# EAGLE design PMNv1-1H (EAGLE 9.5.2)
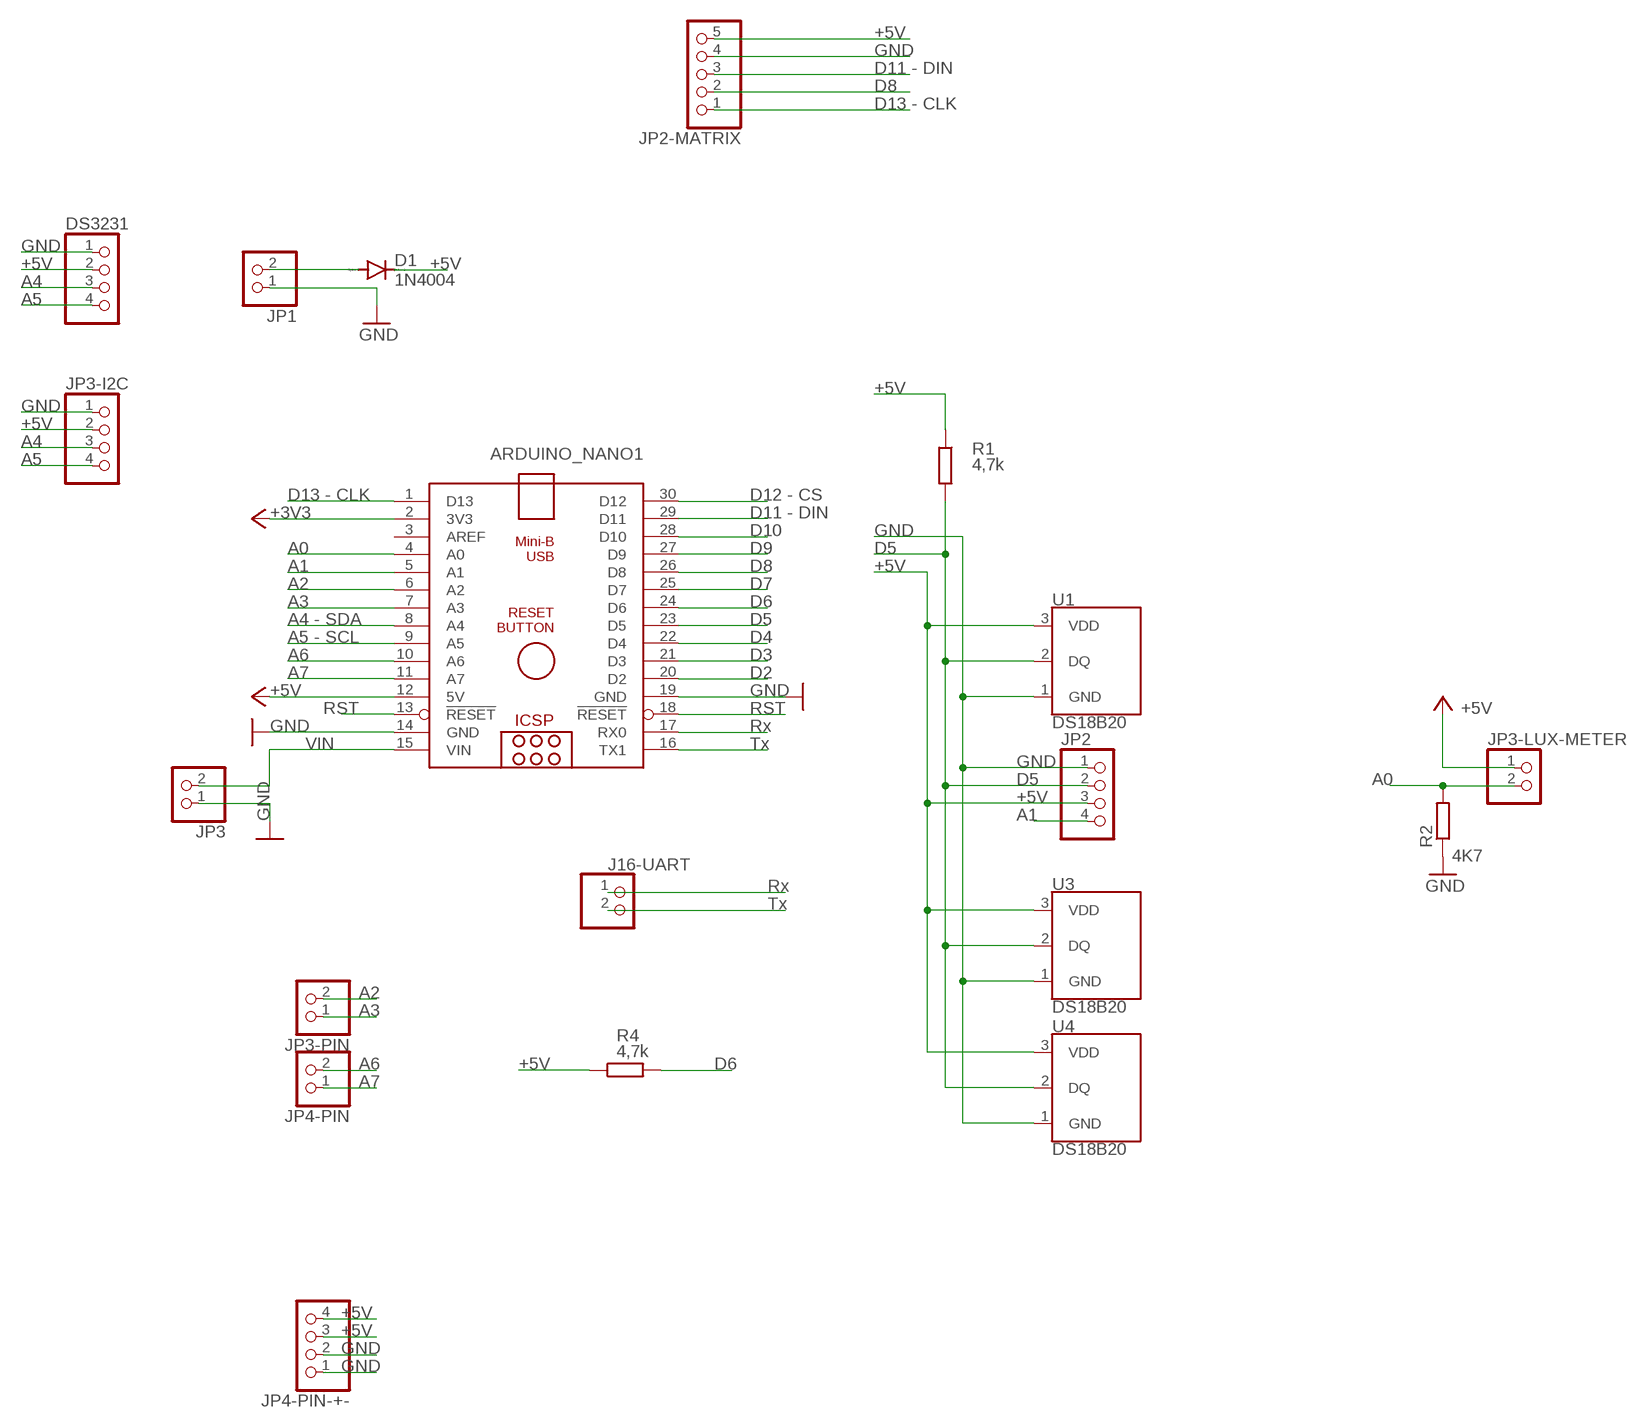
[diagram p0: schematic, sheet 1]

## Parts
ARDUINO_NANO1  ARDUINO_NANO  [ARDUINO_NANO]
D1  1N4004  [DO41-10]
DS3231  PINHD-1X4  [1X04]
J16-UART  PINHD-1X2  [1X02]
JP1  PINHD-1X2  [1X02]
JP2  PINHD-1X4  [1X04]
JP2-MATRIX  PINHD-1X5  [1X05]
JP3  PINHD-1X2  [1X02]
JP3-I2C  PINHD-1X4  [1X04]
JP3-LUX-METER  PINHD-1X2  [1X02]
JP3-PIN  PINHD-1X2  [1X02]
JP4-PIN  PINHD-1X2  [1X02]
JP4-PIN-+-  PINHD-1X4  [1X04]
R1  4,7k  R-EU_0204/7  [0204/7]
R2  4K7  R-EU_0207/10  [0207/10]
R4  4,7k  R-EU_0204/7  [0204/7]
U1  DS18B20  [TO-92-AMMO]
U3  DS18B20  [TO-92-AMMO]
U4  DS18B20  [TO-92-AMMO]

## Nets
+3V3: ARDUINO_NANO1.2(3V3)
+5V: ARDUINO_NANO1.12(5V) D1.C DS3231.2 JP2-MATRIX.5 JP2.3 JP3-I2C.2 JP3-LUX-METER.1 JP4-PIN-+-.3 JP4-PIN-+-.4 R1.1 R4.1 U1.3(VDD) U3.3(VDD) U4.3(VDD)
A0: ARDUINO_NANO1.4(A0) JP3-LUX-METER.2 R2.2
A1: ARDUINO_NANO1.5(A1) JP2.4
A2: ARDUINO_NANO1.6(A2) JP3-PIN.2
A3: ARDUINO_NANO1.7(A3) JP3-PIN.1
A4: ARDUINO_NANO1.8(A4) DS3231.3 JP3-I2C.3
A5: ARDUINO_NANO1.9(A5) DS3231.4 JP3-I2C.4
A6: ARDUINO_NANO1.10(A6) JP4-PIN.2
A7: ARDUINO_NANO1.11(A7) JP4-PIN.1
D2: ARDUINO_NANO1.20(D2)
D3: ARDUINO_NANO1.21(D3)
D4: ARDUINO_NANO1.22(D4)
D5: ARDUINO_NANO1.23(D5) JP2.2 R1.2 U1.2(DQ) U3.2(DQ) U4.2(DQ)
D6: ARDUINO_NANO1.24(D6) R4.2
D7: ARDUINO_NANO1.25(D7)
D8: ARDUINO_NANO1.26(D8) JP2-MATRIX.2
D9: ARDUINO_NANO1.27(D9)
D10: ARDUINO_NANO1.28(D10)
D11: ARDUINO_NANO1.29(D11) JP2-MATRIX.3
D12: ARDUINO_NANO1.30(D12)
D13: ARDUINO_NANO1.1(D13) JP2-MATRIX.1
GND: ARDUINO_NANO1.14(GND) ARDUINO_NANO1.19(GND) DS3231.1 JP1.1 JP2-MATRIX.4 JP2.1 JP3-I2C.1 JP3.1 JP4-PIN-+-.1 JP4-PIN-+-.2 R2.1 U1.1(GND) U3.1(GND) U4.1(GND)
N$2: D1.A JP1.2
RST: ARDUINO_NANO1.13(!RESET) ARDUINO_NANO1.18(!RESET)
RX: ARDUINO_NANO1.17(RX0) J16-UART.1
TX: ARDUINO_NANO1.16(TX1) J16-UART.2
VIN: ARDUINO_NANO1.15(VIN) JP3.2
Unconnected: ARDUINO_NANO1.3(AREF)

## Notes on the sheet
- +5V
- GND
- D11 - DIN
- D13 - CLK
- +5V
- D13 - CLK | D12 - CS
- D11 - DIN
- D10 | GND
- A0 | D9 | D5
- A1 | D8 | +5V
- A2 | D7
- A3 | D6
- A4 - SDA | D5
- A5 - SCL | D4
- A6 | D3
- A7 | D2
- Rx
- VIN | Tx
- Rx
- Tx
- +5V | D6

## Library data of the parts
ARDUINO_NANO1 = ArduinoNanoV30:ARDUINO_NANO: Arduino Nano V3.0 Overview: The Arduino Nano is a small, complete, and breadboard-friendly board based on the ATmega328 (Arduino Nano 3.x) or ATmega168 (Arduino Nano 2.x). It has more or less the same functionality of the Arduino Duemilanove, but in a different package. It lacks only a DC power jack, and works with a Mini-B USB cable instead of a standard one. The Nano was designed and is being produced by Gravitech. Specifications: Microcontroller Atmel ATmega168 or ATmega328 Operating Voltage (logic level) 5 V Input Voltage (recommended) 7-12 V Input Voltage (limits) 6-20 V Digital I/O Pins 14 (of which 6 provide PWM output) Analog Input Pins 8 DC Current per I/O Pin 40 mA Flash Memory 16 KB (ATmega168) or 32 KB (ATmega328) of which 2 KB used by bootloader SRAM 1 KB (ATmega168) or 2 KB (ATmega328) EEPROM 512 bytes (ATmega168) or 1 KB (ATmega328) Clock Speed 16 MHz Dimensions 0.73" x 1.70" Length 45 mm Width 18 mm Weigth 5 g Power: The Arduino Nano can be powered via the Mini-B USB connection, 6-20V unregulated external power supply (pin 30), or 5V regulated external power supply (pin 27). The power source is automatically selected to the highest voltage source. Memory: The ATmega168 has 16 KB of flash memory for storing code (of which 2 KB is used for the bootloader); the ATmega328 has 32 KB, (also with 2 KB used for the bootloader). The ATmega168 has 1 KB of SRAM and 512 bytes of EEPROM (which can be read and written with the EEPROM library); the ATmega328 has 2 KB of SRAM and 1 KB of EEPROM. Input and Output: Each of the 14 digital pins on the Nano can be used as an input or output, using pinMode(), digitalWrite(), and digitalRead() functions. They operate at 5 volts. Each pin can provide or receive a maximum of 40 mA and has an internal pull-up resistor (disconnected by default) of 20-50 kOhms. In addition, some pins have specialized functions. Visit Arduino - ArduinoBoardNano <https://www.arduino.cc/en/Main/ArduinoBoardNano>
D1 = diode:1N4004: DIODE general purpose rectifier, 1 A
DS3231 JP2 JP3-I2C JP4-PIN-+- = pinhead:PINHD-1X4: PIN HEADER
J16-UART JP1 JP3 JP3-LUX-METER JP3-PIN JP4-PIN = pinhead:PINHD-1X2: PIN HEADER
JP2-MATRIX = pinhead:PINHD-1X5: PIN HEADER
R1 R4 = rcl:R-EU_: RESISTOR, European symbol
R2 = rcl:R-EU_: RESISTOR, European symbol; SPICEPREFIX: R
U1 U3 U4 = SparkFun-Sensors:DS18B20: Dallas/Maxim DS18B20 1-Wire Temperature Sensor The DS18B20 reports degrees C with 9 to 12-bit precision, -55C to 125C (+/-0.5C). Each sensor has a unique 64-Bit Serial number etched into it - allows for a huge number of sensors to be used on one data bus. Datasheet <http://datasheets.maximintegrated.com/en/ds/DS18B20.pdf> SparkFun Products One Wire Digital Temperature Sensor - DS18B20 <https://www.sparkfun.com/products/245> (SEN-00245); STORE_ID: SEN-00245

## Board
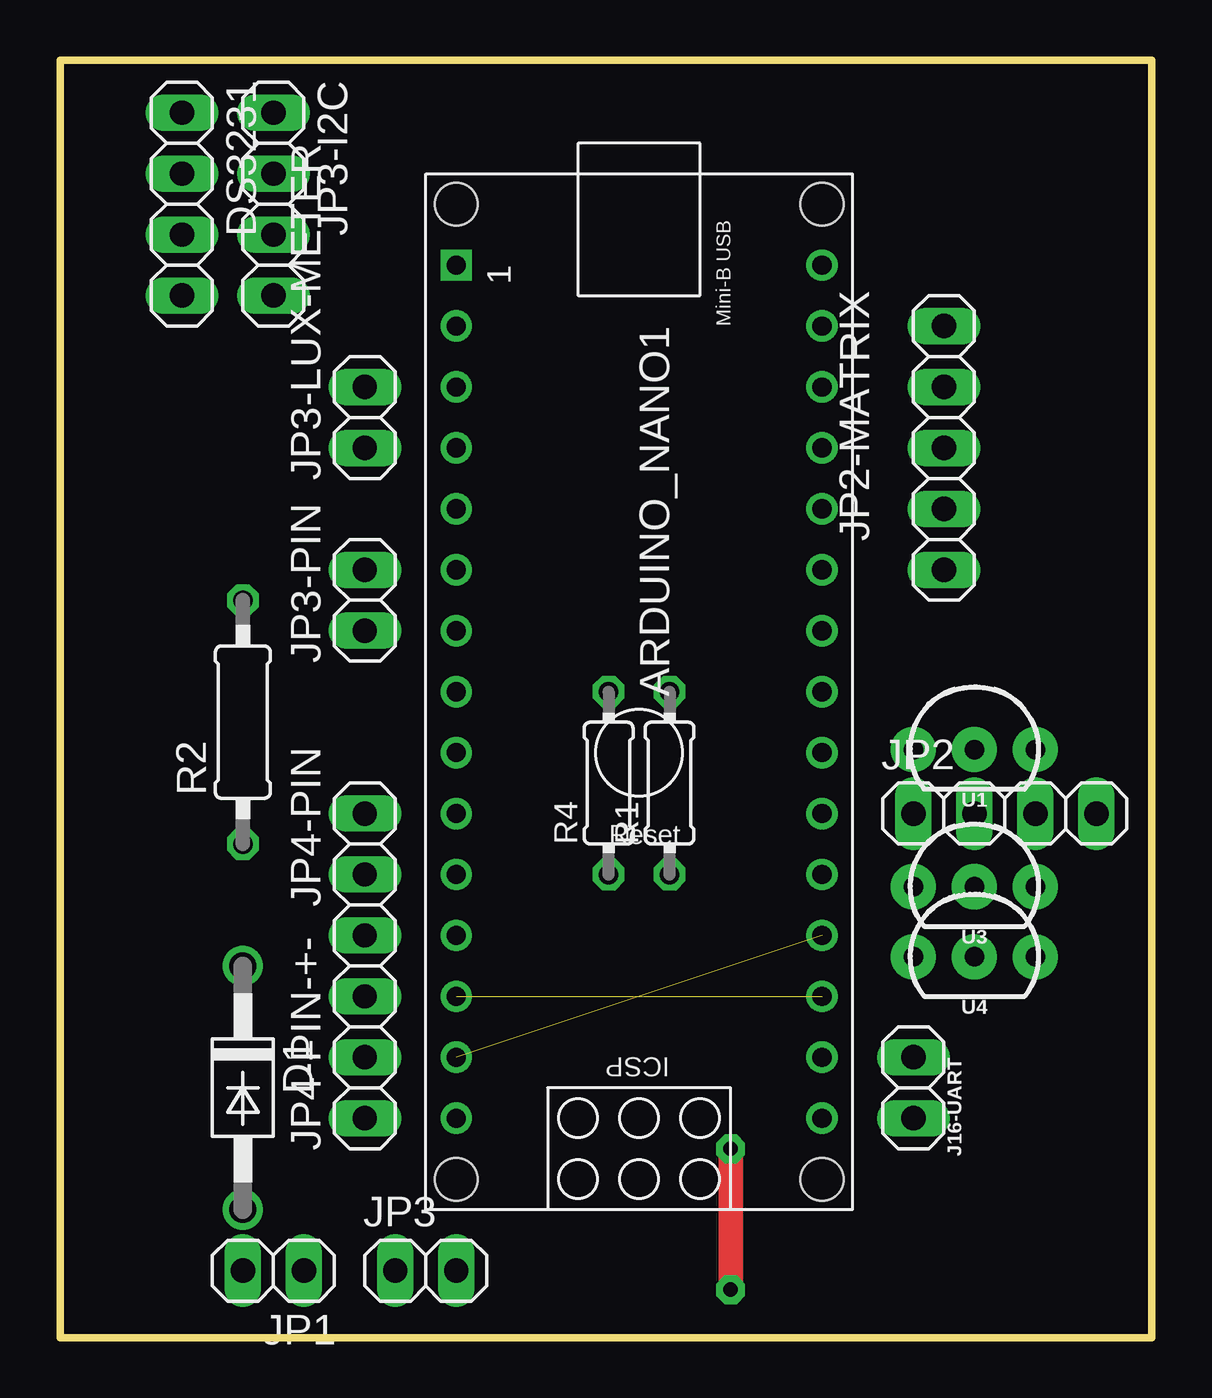
[diagram p1: board, top side]
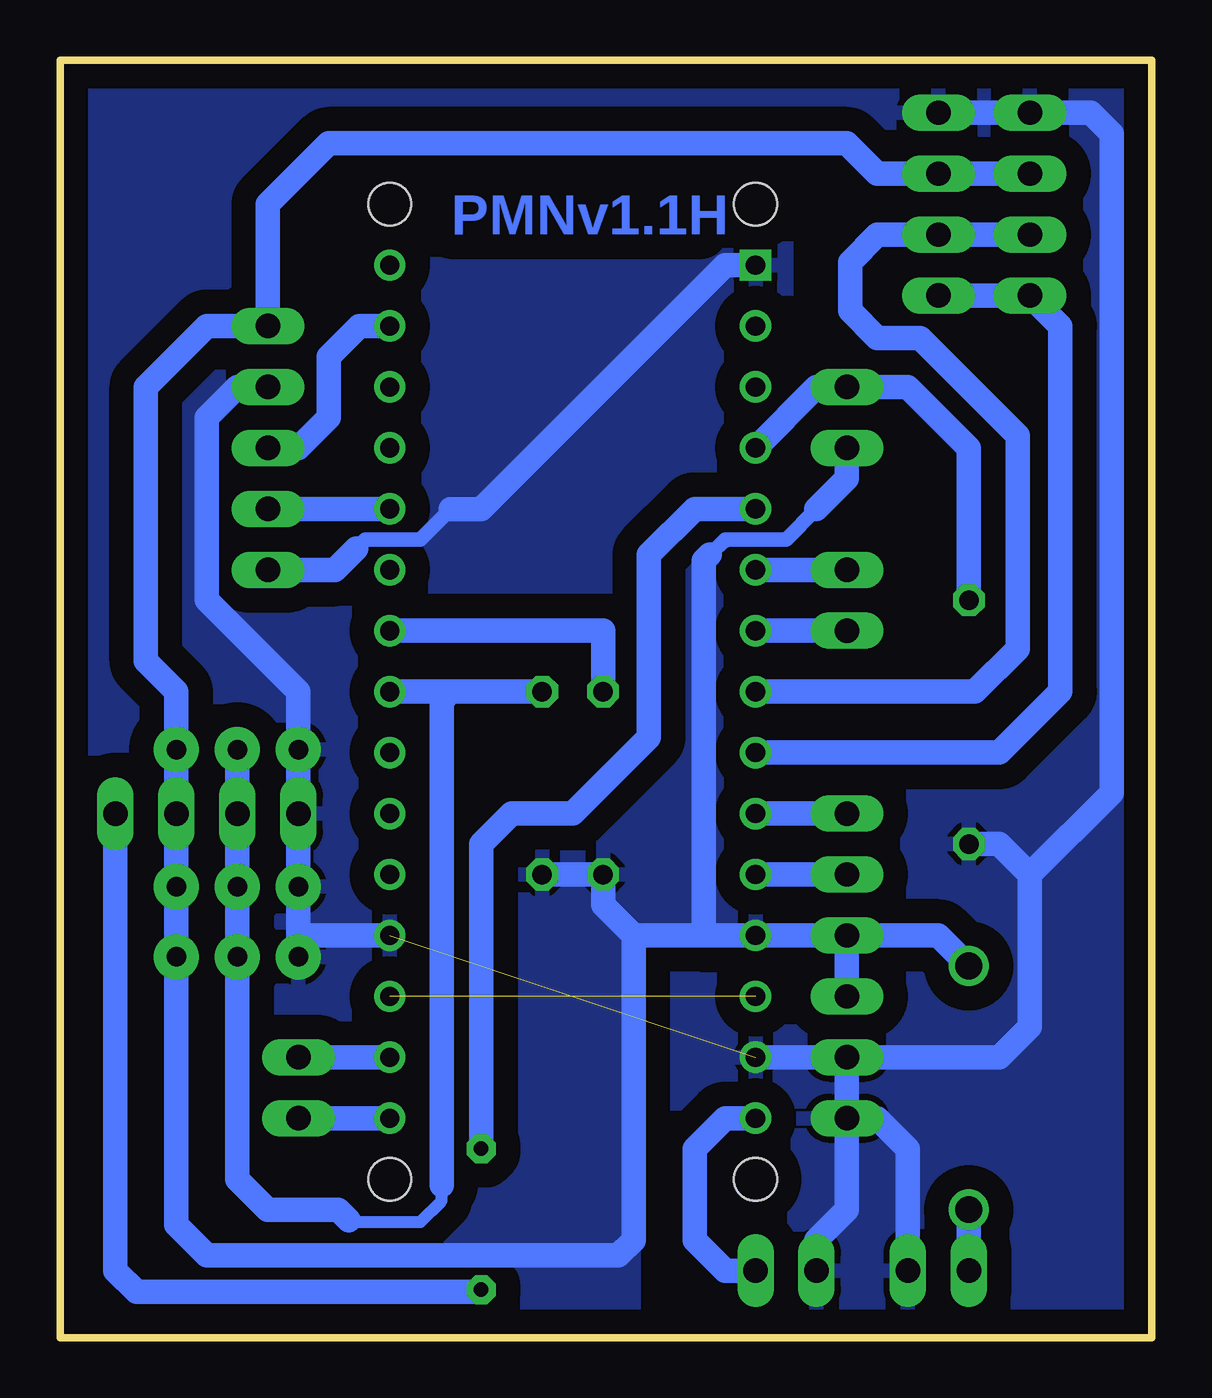
[diagram p2: board, bottom side, seen from below]

Size 45.49 x 53.25 mm. Coordinates in mm from the lower left corner, seen from the top.
Outline: 0,0 45.49,0 45.49,53.25 0,53.25 0,0
Copper layers (1*16): Top 0.035mm / dielectric 1.5mm / Bottom 0.035mm
Design rules "default": minimum track width 6mil, minimum drill 0.35mm, track to track 6mil, track to pad 6mil, pad to pad 6mil, via to via 6mil, smd to smd 6mil, copper to edge 40mil, drill to drill 6mil, minimum pad ring 10mil, minimum via ring 8mil, stop-mask expansion 4mil, vias tented up to drill 0mil, thermal gap 10mil
Holes 3 mm at -10.16,58.67

### Footprints (pad centres in the part's own frame; a part is rotated, then mirrored left to right if it is on the bottom)
ARDUINO_NANO = drill 0.8 square: 1 -20.32,-7.62 | drill 0.8: 2 -17.78,-7.62; 3 -15.24,-7.62; 4 -12.7,-7.62; 5 -10.16,-7.62; 6 -7.62,-7.62; 7 -5.08,-7.62; 8 -2.54,-7.62; 9 0,-7.62; 10 2.54,-7.62; 11 5.08,-7.62; 12 7.62,-7.62; 13 10.16,-7.62; 14 12.7,-7.62; 15 15.24,-7.62; 16 15.24,7.62; 17 12.7,7.62; 18 10.16,7.62; 19 7.62,7.62; 20 5.08,7.62; 21 2.54,7.62; 22 0,7.62; 23 -2.54,7.62; 24 -5.08,7.62; 25 -7.62,7.62; 26 -10.16,7.62; 27 -12.7,7.62; 28 -15.24,7.62; 29 -17.78,7.62; 30 -20.32,7.62 | hole 1.778: -22.86,-7.62; -22.86,7.62; 17.78,7.62; 17.78,-7.62
DO41-10 = drill 1.118: A 5.08,0; C -5.08,0
1X04 = drill 1.016 long: 1 -3.81,0; 2 -1.27,0; 3 1.27,0; 4 3.81,0
1X02 = drill 1.016 long: 1 -1.27,0; 2 1.27,0
1X05 = drill 1.016 long: 1 -5.08,0; 2 -2.54,0; 3 0,0; 4 2.54,0; 5 5.08,0
0204/7 = drill 0.813 octagon: 1 -3.81,0; 2 3.81,0
0207/10 = drill 0.813 octagon: 1 -5.08,0; 2 5.08,0
TO-92-AMMO = drill 0.813 pad 1.88: 1 -2.54,0; 2 0,0; 3 2.54,0

### Placement (x,y rotation side)
ARDUINO_NANO1  24.13,24.38 270 top
D1  7.62,10.41 270 top
DS3231  5.08,47.24 270 top
J16-UART  35.56,10.41 270 top
JP1  8.89,2.79 180 top
JP2  39.37,21.84 0 top
JP2-MATRIX  36.83,37.08 90 top
JP3  15.24,2.79 0 top
JP3-I2C  8.89,47.24 270 top
JP3-LUX-METER  12.7,38.35 90 top
JP3-PIN  12.7,30.73 90 top
JP4-PIN  12.7,20.57 90 top
JP4-PIN-+-  12.7,12.95 90 top
R1  25.4,23.11 90 top
R2  7.62,25.65 90 top
R4  22.86,23.11 90 top
U1  38.1,24.51 0 top
U3  38.1,18.8 0 top
U4  38.1,15.88 0 top

### Tracks (layer width: path | path; a pad name or v marks a point on that pad's centre or on a via)
+5V
  Bottom 0.61: 13.97,34.54 15.24,33.27 17.68,33.27 | 17.73,33.23 17.68,33.27 | 17.68,33.27 17.78,33.27 18.41,32.64
  Bottom 1.016: R1.1 R4.1 22.86,18.03 21.59,16.76 | JP4-PIN-+-.3 JP4-PIN-+-.4 | U3.3 JP2.3 U1.3 40.64,26.92 41.91,28.19 41.91,39.62 39.37,42.16 JP2-MATRIX.5 36.83,47.24 34.29,49.78 12.7,49.78 11.43,48.51 JP3-I2C.2 DS3231.2 | 40.64,18.03 U3.3 | U3.3 U4.3 40.64,4.7 39.37,3.43 22.22,3.43 21.59,4.06 21.59,16.76 | D1.C 8.89,16.76 JP4-PIN-+-.4 | JP4-PIN-+-.4 ARDUINO_NANO1.12 18.67,16.76 | 18.67,16.76 21.59,16.76 | JP3-LUX-METER.1 12.7,35.81 13.97,34.54 | 18.41,32.64 18.67,32.38 18.67,16.76
  pour Bottom (isolate 1.016, rank 4): 20.32,0.25 21.59,1.52 21.59,18.03 20.32,16.76 16.51,16.76 16.51,32 20.32,32 29.21,23.11 29.21,0.25
A0
  Bottom 1.016: ARDUINO_NANO1.4 13.97,39.62 JP3-LUX-METER.2 10.16,39.62 7.62,37.08 R2.2
A1  (via drill 0.6 pad 1.2)
  Top 1.016: v27.94,7.87 v27.94,2
  Bottom 1.016: ARDUINO_NANO1.5 19.05,34.54 20.96,32.64 20.96,25.02 24.13,21.84 26.67,21.84 27.94,20.57 v27.94,7.87 | v27.94,2 27.94,1.91 42.29,1.91 43.18,2.79 JP2.4
A2
  Bottom 1.016: ARDUINO_NANO1.6 JP3-PIN.2
A3
  Bottom 1.016: ARDUINO_NANO1.7 JP3-PIN.1
A4
  Bottom 1.016: ARDUINO_NANO1.8 7.37,26.92 5.59,28.7 5.59,37.59 9.65,41.66 11.43,41.66 12.57,42.8 12.57,44.83 11.43,45.97 JP3-I2C.3 DS3231.3
A5
  Bottom 1.016: ARDUINO_NANO1.9 6.35,24.38 3.81,26.92 3.81,42.16 DS3231.4 JP3-I2C.4
A6
  Bottom 1.016: ARDUINO_NANO1.10 JP4-PIN.2
A7
  Bottom 1.016: ARDUINO_NANO1.11 JP4-PIN.1
D5
  Bottom 0.508: 29.59,6.35 29.59,5.71 30.47,4.83 33.39,4.83 33.46,4.9
  Bottom 1.016: R1.2 29.21,26.92 | ARDUINO_NANO1.23 29.21,26.92 | 33.46,4.9 33.89,5.33 36.83,5.33 38.1,6.6 U4.2 U3.2 JP2.2 U1.2 | 29.59,6.35 29.59,26.54 29.21,26.92
D6
  Bottom 1.016: ARDUINO_NANO1.24 22.86,29.46 R4.2
D8
  Bottom 1.016: JP2-MATRIX.2 ARDUINO_NANO1.26
D11
  Bottom 1.016: JP2-MATRIX.3 35.56,37.08 34.29,38.35 34.29,40.89 33.02,42.16 ARDUINO_NANO1.29
D13
  Bottom 0.61: 33.15,32.89 32.77,33.27 30.48,33.27 29.21,34.54
  Bottom 1.016: ARDUINO_NANO1.1 17.78,44.7 27.94,34.54 29.21,34.54 | JP2-MATRIX.1 34.04,32 33.15,32.89
  pour Bottom (isolate 1.016, rank 4): 15.24,48.51 33.02,48.51 33.02,29.46 11.43,29.46 15.24,33.27
GND  (1 unrouted)
  Bottom 1.016: JP4-PIN-+-.1 JP4-PIN-+-.2 | JP2-MATRIX.4 38.1,39.62 39.37,38.35 39.37,30.73 35.56,26.92 U1.1 JP2.1 U3.1 U4.1 35.56,16.76 ARDUINO_NANO1.19 | ARDUINO_NANO1.14 JP4-PIN-+-.2 | JP3-I2C.1 DS3231.1 2.54,51.05 1.68,50.19 1.68,22.71 5.08,19.3 | JP4-PIN-+-.1 11.43,9.14 10.16,7.87 JP1.1 | JP3.1 13.97,4.06 12.7,5.33 JP4-PIN-+-.1 | JP4-PIN-+-.2 6.35,11.68 5.08,12.95 5.08,19.3 | R2.1 6.35,20.57 5.08,19.3
  pour Bottom (isolate 1.016, rank 5): -2.54,56.13 -3.81,54.86 -3.81,-3.56 49.53,-3.56 49.53,57.4 48.26,56.13
N$2
  Bottom 1.016: JP1.2 D1.A
RST  (1 unrouted)
RX
  Bottom 1.016: J16-UART.1 ARDUINO_NANO1.17
TX
  Bottom 1.016: J16-UART.2 ARDUINO_NANO1.16
VIN
  Bottom 1.016: JP3.2 17.78,2.79 19.05,4.06 19.05,7.87 17.78,9.14 ARDUINO_NANO1.15

### Text on the board
Bottom: PMNv1.1H